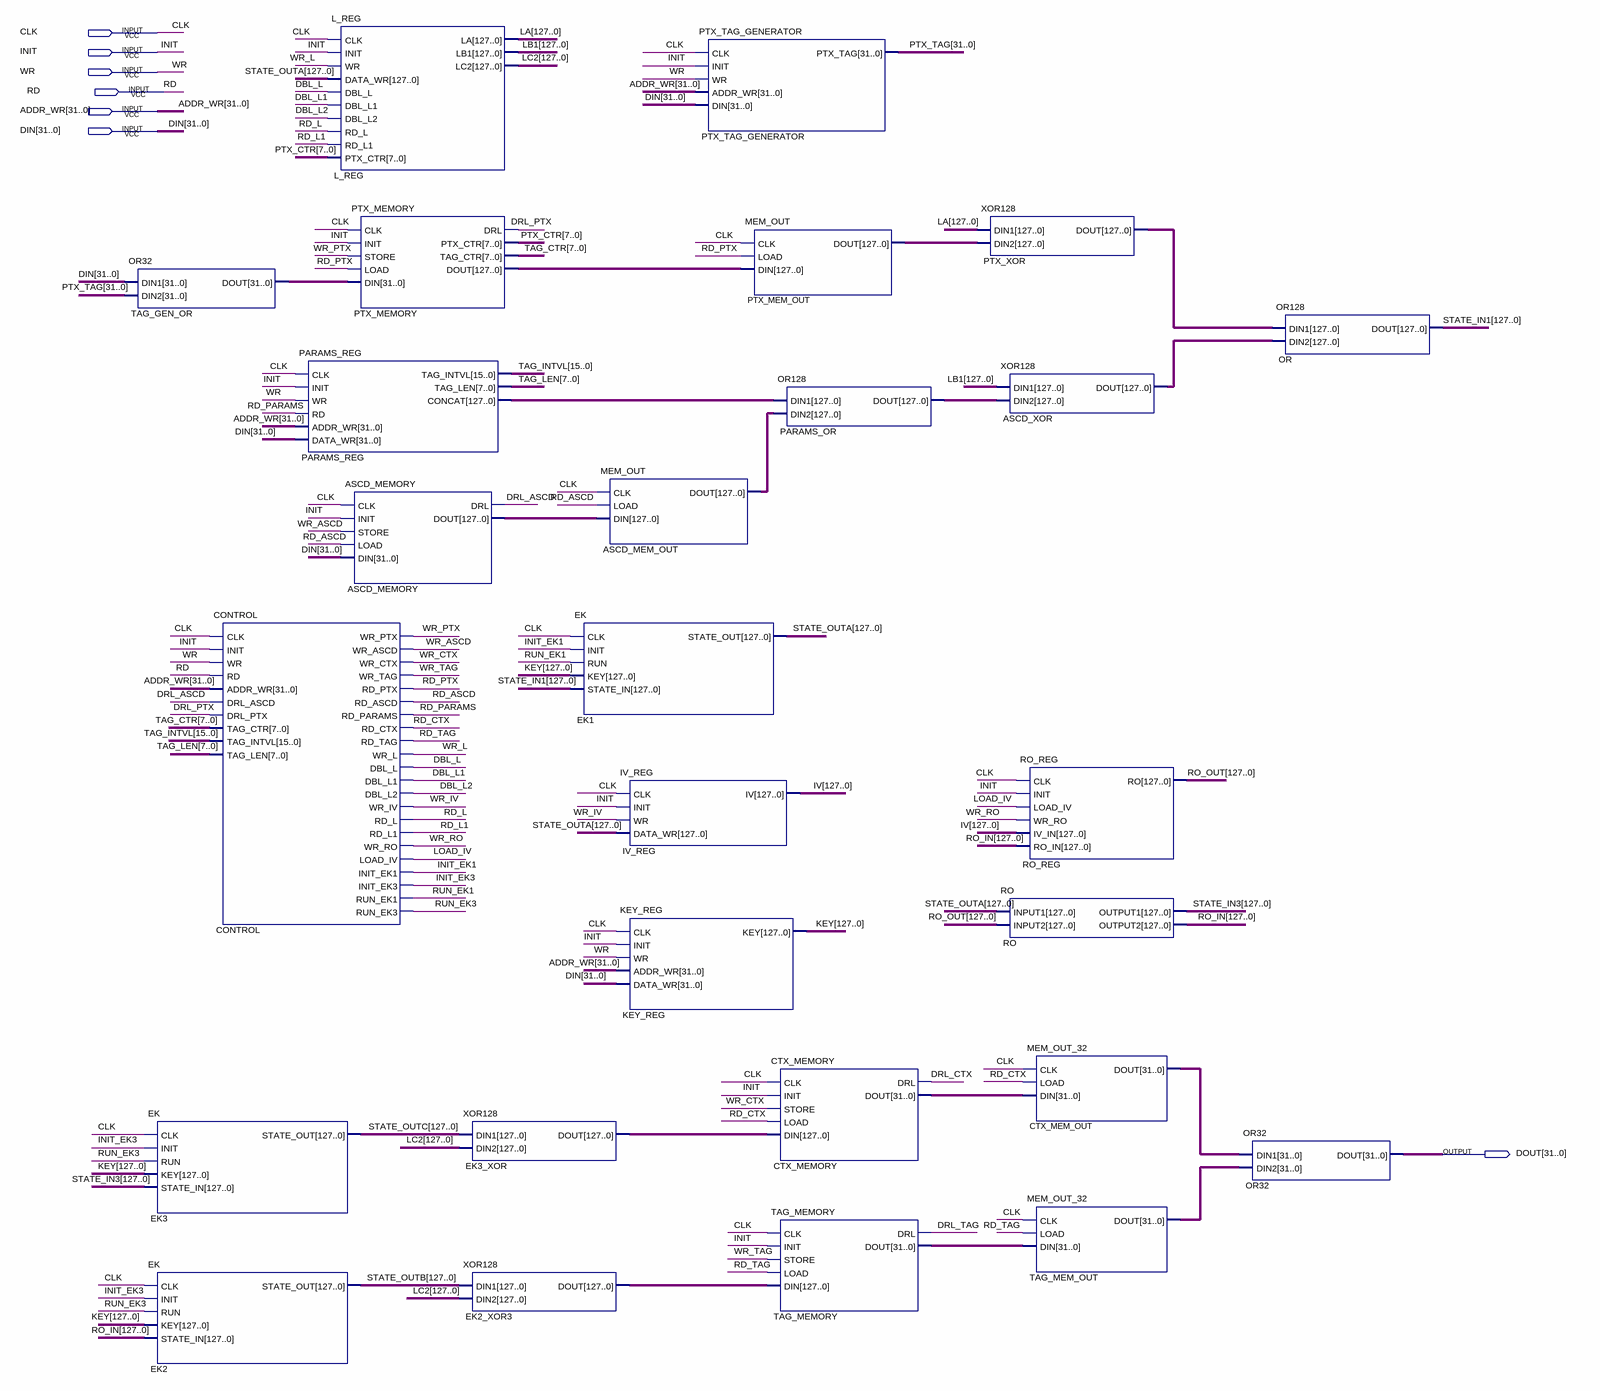
[diagram p0: schematic sheet]
// Quartus schematic COLM.bdf as structural Verilog: 27 symbols, 7 pins
module COLM (
  input  CLK,
  input  INIT,
  input  WR,
  input  RD,
  input  [31:0] ADDR_WR,
  input  [31:0] DIN,
  output [31:0] DOUT
);

  wire DBL_L, DBL_L1, DBL_L2, DRL_ASCD, DRL_CTX, DRL_PTX, DRL_TAG, INIT_EK1, INIT_EK3, LOAD_IV, RD_ASCD,
       RD_CTX, RD_L, RD_L1, RD_PARAMS, RD_PTX, RD_TAG, RUN_EK1, RUN_EK3, WR_ASCD, WR_CTX, WR_IV, WR_L,
       WR_PTX, WR_RO, WR_TAG;
  wire [7:0] PTX_CTR, TAG_CTR, TAG_LEN;
  wire [15:0] TAG_INTVL;
  wire [31:0] CTX_MEM_OUT_dout, CTX_MEMORY_dout, PTX_TAG, TAG_GEN_OR_dout, TAG_MEM_OUT_dout, TAG_MEMORY_dout;
  wire [127:0] ASCD_MEM_OUT_dout, ASCD_MEMORY_dout, ASCD_XOR_dout, EK2_XOR3_dout, EK3_XOR_dout, IV, KEY, LA,
       LB1, LC2, PARAMS_OR_dout, PARAMS_REG_concat, PTX_MEM_OUT_dout, PTX_MEMORY_dout, PTX_XOR_dout, RO_IN,
       RO_OUT, STATE_IN1, STATE_IN3, STATE_OUTA, STATE_OUTB, STATE_OUTC;

  OR32 TAG_GEN_OR (.DIN1(DIN), .DIN2(PTX_TAG), .DOUT(TAG_GEN_OR_dout));
  EK EK3 (.CLK(CLK), .INIT(INIT_EK3), .RUN(RUN_EK3), .KEY(KEY), .STATE_IN(STATE_IN3), .STATE_OUT(STATE_OUTC));
  EK EK2 (.CLK(CLK), .INIT(INIT_EK3), .RUN(RUN_EK3), .KEY(KEY), .STATE_IN(RO_IN), .STATE_OUT(STATE_OUTB));
  CONTROL CONTROL (
    .CLK(CLK), .INIT(INIT), .WR(WR), .RD(RD), .ADDR_WR(ADDR_WR), .DRL_ASCD(DRL_ASCD), .DRL_PTX(DRL_PTX),
    .TAG_CTR(TAG_CTR), .TAG_INTVL(TAG_INTVL), .TAG_LEN(TAG_LEN), .WR_PTX(WR_PTX), .WR_ASCD(WR_ASCD),
    .WR_CTX(WR_CTX), .WR_TAG(WR_TAG), .RD_PTX(RD_PTX), .RD_ASCD(RD_ASCD), .RD_PARAMS(RD_PARAMS),
    .RD_CTX(RD_CTX), .RD_TAG(RD_TAG), .WR_L(WR_L), .DBL_L(DBL_L), .DBL_L1(DBL_L1), .DBL_L2(DBL_L2),
    .WR_IV(WR_IV), .RD_L(RD_L), .RD_L1(RD_L1), .WR_RO(WR_RO), .LOAD_IV(LOAD_IV), .INIT_EK1(INIT_EK1),
    .INIT_EK3(INIT_EK3), .RUN_EK1(RUN_EK1), .RUN_EK3(RUN_EK3));
  L_REG L_REG (
    .CLK(CLK), .INIT(INIT), .WR(WR_L), .DATA_WR(STATE_OUTA), .DBL_L(DBL_L), .DBL_L1(DBL_L1), .DBL_L2(DBL_L2),
    .RD_L(RD_L), .RD_L1(RD_L1), .PTX_CTR(PTX_CTR), .LA(LA), .LB1(LB1), .LC2(LC2));
  PARAMS_REG PARAMS_REG (
    .CLK(CLK), .INIT(INIT), .WR(WR), .RD(RD_PARAMS), .ADDR_WR(ADDR_WR), .DATA_WR(DIN), .TAG_INTVL(TAG_INTVL),
    .TAG_LEN(TAG_LEN), .CONCAT(PARAMS_REG_concat));
  ASCD_MEMORY ASCD_MEMORY (
    .CLK(CLK), .INIT(INIT), .STORE(WR_ASCD), .LOAD(RD_ASCD), .DIN(DIN), .DRL(DRL_ASCD),
    .DOUT(ASCD_MEMORY_dout));
  PTX_MEMORY PTX_MEMORY (
    .CLK(CLK), .INIT(INIT), .STORE(WR_PTX), .LOAD(RD_PTX), .DIN(TAG_GEN_OR_dout), .DRL(DRL_PTX),
    .PTX_CTR(PTX_CTR), .TAG_CTR(TAG_CTR), .DOUT(PTX_MEMORY_dout));
  XOR128 EK3_XOR (.DIN1(STATE_OUTC), .DIN2(LC2), .DOUT(EK3_XOR_dout));
  XOR128 EK2_XOR3 (.DIN1(STATE_OUTB), .DIN2(LC2), .DOUT(EK2_XOR3_dout));
  MEM_OUT ASCD_MEM_OUT (.CLK(CLK), .LOAD(RD_ASCD), .DIN(ASCD_MEMORY_dout), .DOUT(ASCD_MEM_OUT_dout));
  EK EK1 (.CLK(CLK), .INIT(INIT_EK1), .RUN(RUN_EK1), .KEY(KEY), .STATE_IN(STATE_IN1), .STATE_OUT(STATE_OUTA));
  IV_REG IV_REG (.CLK(CLK), .INIT(INIT), .WR(WR_IV), .DATA_WR(STATE_OUTA), .IV(IV));
  KEY_REG KEY_REG (.CLK(CLK), .INIT(INIT), .WR(WR), .ADDR_WR(ADDR_WR), .DATA_WR(DIN), .KEY(KEY));
  PTX_TAG_GENERATOR PTX_TAG_GENERATOR (
    .CLK(CLK), .INIT(INIT), .WR(WR), .ADDR_WR(ADDR_WR), .DIN(DIN), .PTX_TAG(PTX_TAG));
  MEM_OUT PTX_MEM_OUT (.CLK(CLK), .LOAD(RD_PTX), .DIN(PTX_MEMORY_dout), .DOUT(PTX_MEM_OUT_dout));
  OR128 PARAMS_OR (.DIN1(PARAMS_REG_concat), .DIN2(ASCD_MEM_OUT_dout), .DOUT(PARAMS_OR_dout));
  CTX_MEMORY CTX_MEMORY (
    .CLK(CLK), .INIT(INIT), .STORE(WR_CTX), .LOAD(RD_CTX), .DIN(EK3_XOR_dout), .DRL(DRL_CTX),
    .DOUT(CTX_MEMORY_dout));
  TAG_MEMORY TAG_MEMORY (
    .CLK(CLK), .INIT(INIT), .STORE(WR_TAG), .LOAD(RD_TAG), .DIN(EK2_XOR3_dout), .DRL(DRL_TAG),
    .DOUT(TAG_MEMORY_dout));
  XOR128 PTX_XOR (.DIN1(LA), .DIN2(PTX_MEM_OUT_dout), .DOUT(PTX_XOR_dout));
  XOR128 ASCD_XOR (.DIN1(LB1), .DIN2(PARAMS_OR_dout), .DOUT(ASCD_XOR_dout));
  RO_REG RO_REG (.CLK(CLK), .INIT(INIT), .LOAD_IV(LOAD_IV), .WR_RO(WR_RO), .IV_IN(IV), .RO_IN(RO_IN), .RO(RO_OUT));
  RO RO (.INPUT1(STATE_OUTA), .INPUT2(RO_OUT), .OUTPUT1(STATE_IN3), .OUTPUT2(RO_IN));
  MEM_OUT_32 CTX_MEM_OUT (.CLK(CLK), .LOAD(RD_CTX), .DIN(CTX_MEMORY_dout), .DOUT(CTX_MEM_OUT_dout));
  MEM_OUT_32 TAG_MEM_OUT (.CLK(CLK), .LOAD(RD_TAG), .DIN(TAG_MEMORY_dout), .DOUT(TAG_MEM_OUT_dout));
  OR128 OR (.DIN1(PTX_XOR_dout), .DIN2(ASCD_XOR_dout), .DOUT(STATE_IN1));
  OR32 OR32 (.DIN1(CTX_MEM_OUT_dout), .DIN2(TAG_MEM_OUT_dout), .DOUT(DOUT));
endmodule
